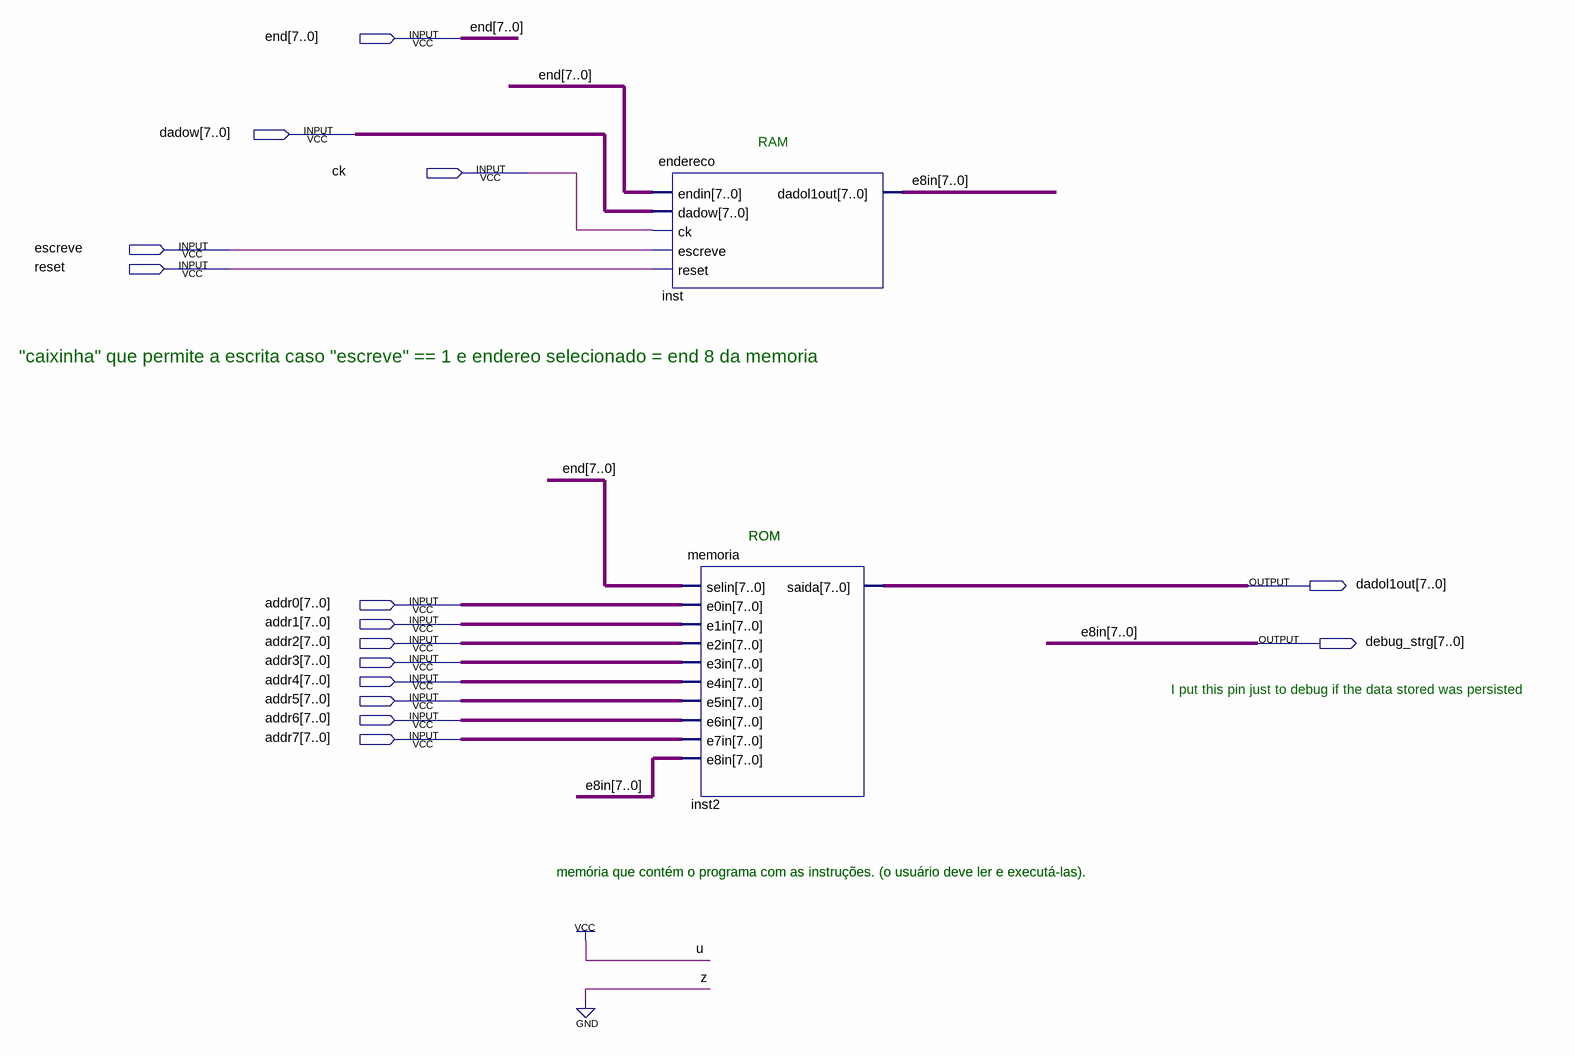
[diagram p0: schematic sheet]
// Quartus schematic memdbg.bdf as structural Verilog: 2 symbols, 15 pins
module memdbg (
  input  [7:0] \end ,
  input  [7:0] dadow,
  input  ck,
  input  escreve,
  input  reset,
  input  [7:0] addr0,
  input  [7:0] addr1,
  input  [7:0] addr2,
  input  [7:0] addr3,
  input  [7:0] addr4,
  input  [7:0] addr5,
  input  [7:0] addr6,
  input  [7:0] addr7,
  output [7:0] dadol1out,
  output [7:0] debug_strg
);

  endereco inst (.endin(\end ), .dadow(dadow), .ck(ck), .escreve(escreve), .reset(reset), .dadol1out(debug_strg));
  memoria inst2 (
    .selin(\end ), .e0in(addr0), .e1in(addr1), .e2in(addr2), .e3in(addr3), .e4in(addr4), .e5in(addr5),
    .e6in(addr6), .e7in(addr7), .e8in(debug_strg), .saida(dadol1out));

  // Other names for the same wires on the sheet: e8in[7:0] = debug_strg

  // Notes on the sheet:
  //   RAM
  //   "caixinha" que permite a escrita caso "escreve" == 1 e endereo selecionado = end 8 da memoria
  //   ROM
  //   ROM
  //   I put this pin just to debug if the data stored was persisted
  //   memória que contém o programa com as instruções. (o usuário deve ler e executá-las).
  //   memória que contém o programa com as instruções. (o usuário deve ler e executá-las).
endmodule
